# Altium project Nespi_front_panel_altium.PrjPcb
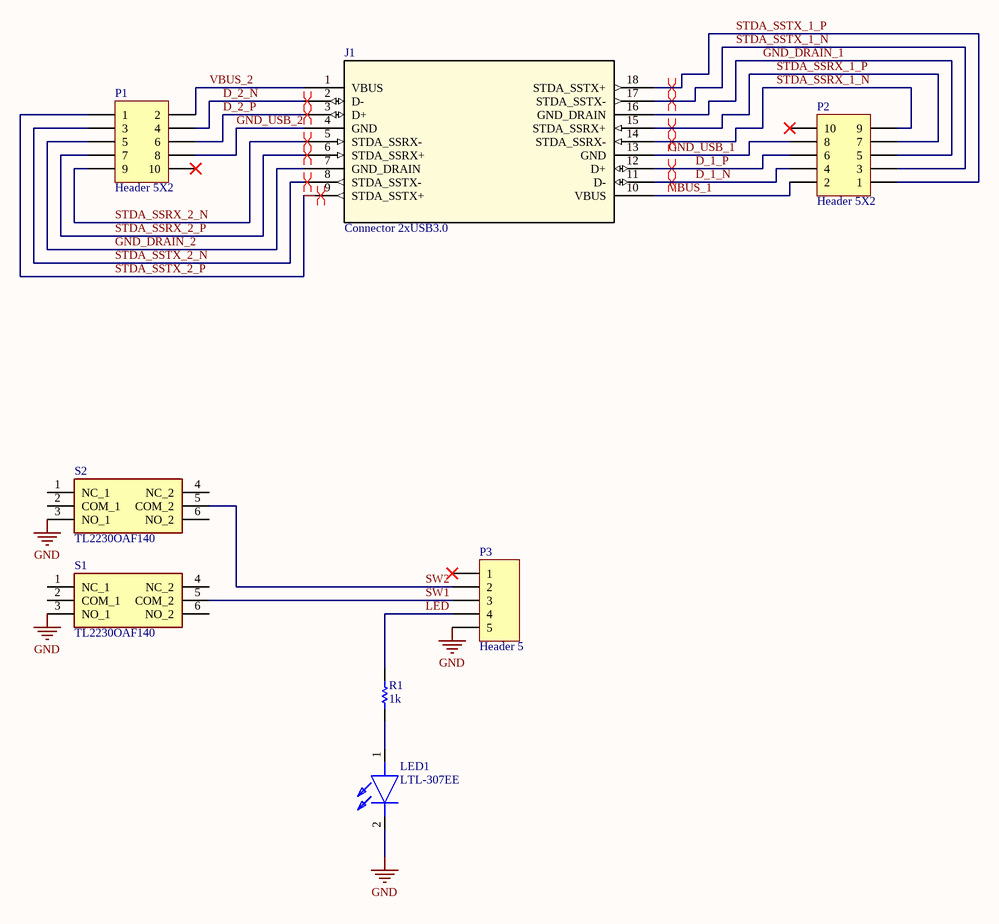
[diagram p0: Sheet1.SchDoc]
1 sheet, 8 parts. Net scope: global (net labels, ports and power ports of the same name join across sheets).
Board file: Front_panel.PcbDoc

## Sheet Sheet1.SchDoc
size A4

### Parts
J1  Connector 2xUSB3.0  [48409-0003]
LED1  LTL-307EE  [LTL307YE]
P1  Header 5X2  [HDR2X5]
P2  Header 5X2  [HDR2X5]
P3  Header 5  [HDR1X5]
R1  1k  [res-smd-0603]
S1  TL2230OAF140  [TL2230OAF140]
S2  TL2230OAF140  [TL2230OAF140]

### Nets
GND: LED1.2(K) P3.5 S1.3(NO_1) S2.3(NO_1)
D_1_N: J1.11(D-) P2.4
D_1_P: J1.12(D+) P2.6
D_2_N: J1.2(D-) P1.4
D_2_P: J1.3(D+) P1.6
GND_DRAIN_1: J1.16(GND_DRAIN) P2.5
GND_DRAIN_2: J1.7(GND_DRAIN) P1.5
GND_USB_1: J1.13(GND) P2.8
GND_USB_2: J1.4(GND) P1.8
LED: P3.4 R1.2
STDA_SSRX_1_N: J1.14(STDA_SSRX-) P2.9
STDA_SSRX_1_P: J1.15(STDA_SSRX+) P2.7
STDA_SSRX_2_N: J1.5(STDA_SSRX-) P1.9
STDA_SSRX_2_P: J1.6(STDA_SSRX+) P1.7
STDA_SSTX_1_N: J1.17(STDA_SSTX-) P2.3
STDA_SSTX_1_P: J1.18(STDA_SSTX+) P2.1
STDA_SSTX_2_N: J1.8(STDA_SSTX-) P1.3
STDA_SSTX_2_P: J1.9(STDA_SSTX+) P1.1
SW1: P3.3 S1.5(COM_2)
SW2: P3.2 S2.5(COM_2)
VBUS_1: J1.10(VBUS) P2.2
VBUS_2: J1.1(VBUS) P1.2
NetLED1_1: LED1.1(A) R1.1

Not connected (* = marked no-connect by the designer): P1 10*; P2 10*; P3 1*; S1 1(NC_1) 2(COM_1) 4(NC_2) 6(NO_2); S2 1(NC_1) 2(COM_1) 4(NC_2) 6(NO_2)

### Layout directives
differential pair: D_1_N, D_1_P, D_2_N, D_2_P, STDA_SSRX_1_N, STDA_SSRX_1_P, STDA_SSRX_2_N, STDA_SSRX_2_P, STDA_SSTX_1_N, STDA_SSTX_1_P, STDA_SSTX_2_N, STDA_SSTX_2_P

### Library data of the parts
J1 = 48409-0003: Conector 2xUSB3.0 Molex; Mfr_Name: Molex Connector Corporation; Manufacturer_Part_Number: 484090003; Copyright: Copyright (C) 2021 Ultra Librarian. All rights reserved.; RefDes: RefDes; Type: DEV
LED1 = LTL-307EE: LED Red; Manufacturer_Name: Lite-On; Datasheet Link: http://media.digikey.com/pdf/Data%20Sheets/Lite-On%20PDFs/LTL-307EE.pdf; Height: 9.85mm; Manufacturer_Part_Number: LTL-307EE
P1 P2 = Header 5X2: Header, 5-Pin, Dual row; LatestRevisionDate: 17-Jul-2002; LatestRevisionNote: Re-released for DXP Platform.; Publisher: Altium Limited
P3 = Header 5: Header, 5-Pin; LatestRevisionDate: 17-Jul-2002; LatestRevisionNote: Re-released for DXP Platform.; Publisher: Altium Limited
R1 = Res1: Resistor; Published: 8-Jun-2000; LatestRevisionDate: 17-Jul-2002; LatestRevisionNote: Re-released for DXP Platform.; PackageReference: AXIAL-0.3; Publisher: Altium Limited; PackageDescription: Axial Device, Thru-Hole; 2 Leads; 0.3 in Pin Spacing; Value: 1k
S1 S2 = TL2230OAF140: Switch Momentary; Manufacturer_Name: E-Switch; Datasheet Link: https://componentsearchengine.com//TL2230OAF140.pdf; Height: 12.5mm; Mouser2 Part Number: 612-TL2230-OA; Mouser2 Price/Stock: https://www.mouser.com/Search/Refine.aspx?Keyword=612-TL2230-OA; Manufacturer_Part_Number: TL2230OAF140